# EAGLE design CC2533_PCB_Main_Plane (EAGLE 6.4)
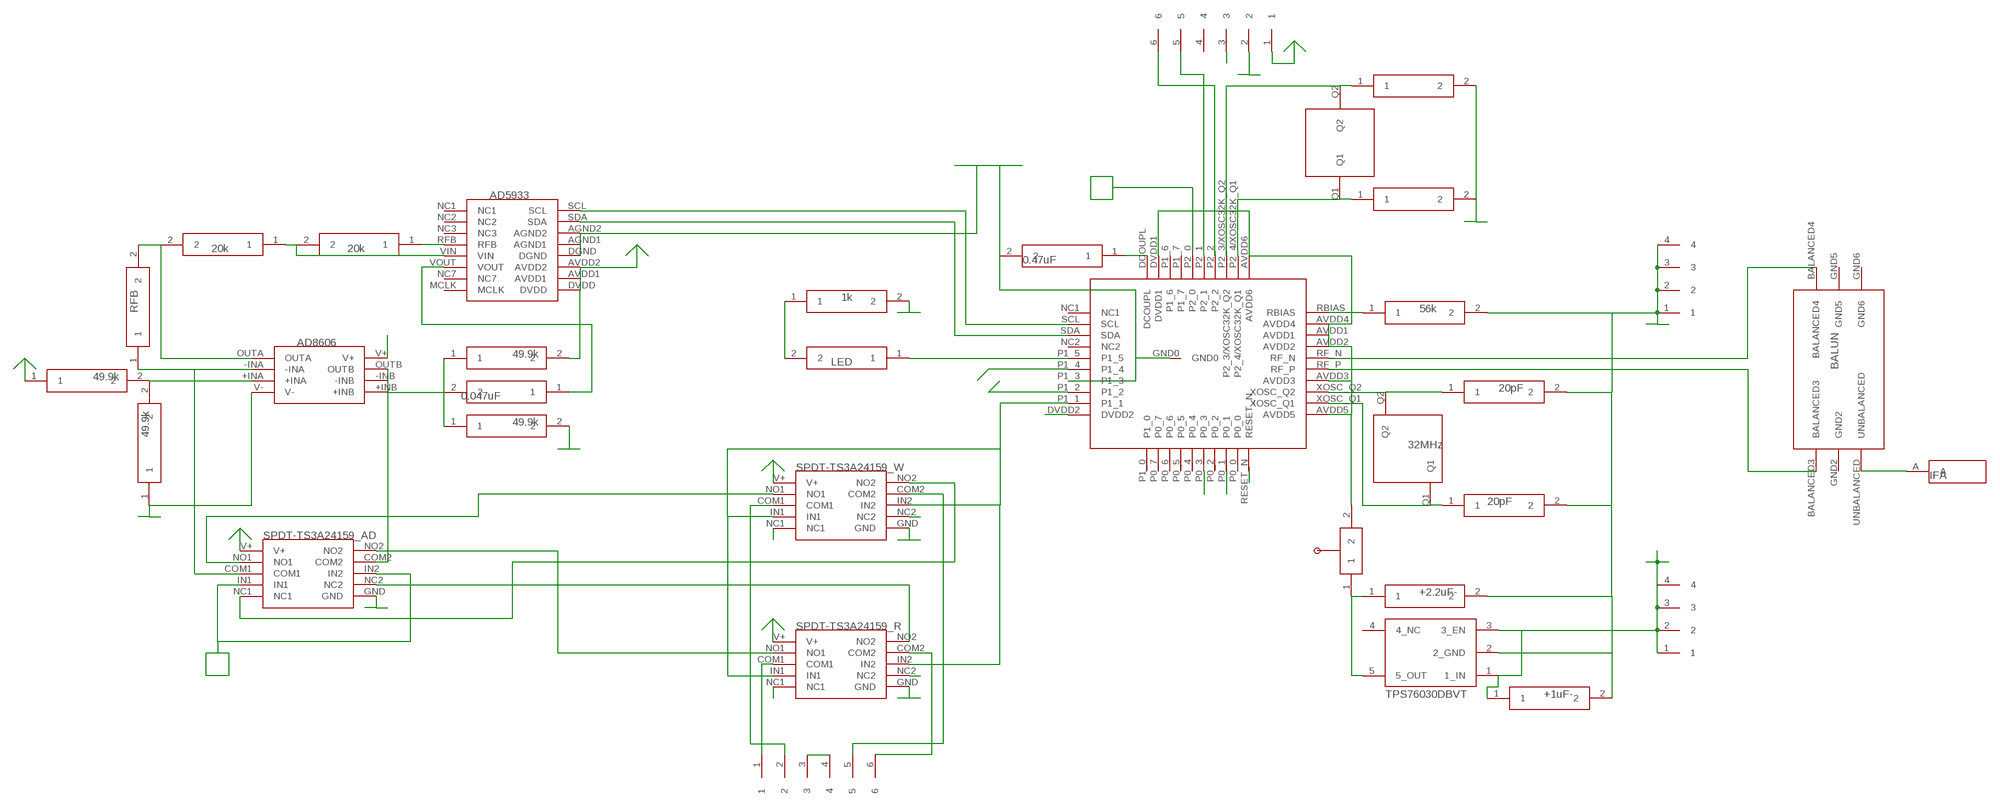
[diagram p0: schematic, sheet 1]

## Parts
U$1  CC2533  [CC2533]
U$2  BALUN  [BALUN]
U$3  X32MHZ  [X32MHZ]
U$4  0201  [0201]
U$5  0201  [0201]
U$6  ANTENNA_BOTTOM  [ANTENNA_BOTTOM]
U$7  FFC4POS  [FFC4POS]
U$8  FFC4POS  [FFC4POS]
U$9  56k  0201  [0201]
U$10  REGULATOR  [REGULATOR]
U$11  0603  [0603]
U$12  0603  [0603]
U$13  SPDT_DUAL  [SPDT_DUAL]
U$14  0201  [0201]
U$15  SPDT_DUAL  [SPDT_DUAL]
U$16  AD5933  [AD5933]
U$17  FFC6POS  [FFC6POS]
U$18  SWITCH_MANUAL  [SWITCH_MANUAL]
U$19  SPDT_DUAL  [SPDT_DUAL]
U$20  AD8606_OPAMP  [AD8606_OPAMP]
U$21  0603_RES  [0603_RES]
U$22  0603_RES  [0603_RES]
U$23  0603_RES  [0603_RES]
U$24  0201  [0201]
U$25  0201  [0201]
U$26  0402_CAP  [0402_CAP]
U$27  0201  [0201]
U$28  0201  [0201]
U$29  0603_RES  [0603_RES]
U$30  FFC6POS  [FFC6POS]
U$31  0402  [0402]
U$39  X32.768KHZ  [X32.768KHZ]
U$40  0201  [0201]
U$41  0201  [0201]

## Nets
GND: U$1.GND0 U$1.P1_3 U$4.2 U$5.2 U$8.1 U$8.2 U$8.3 U$8.4 U$9.2 U$10.2(2_GND) U$11.2 U$12.2 U$13.GND U$14.2 U$15.GND U$16.AGND1 U$16.AGND2 U$16.DGND U$17.2 U$19.GND U$20.V- U$25.1 U$28.2 U$30.3 U$30.4 U$31.2 U$40.2 U$41.2
IN1: U$1.P1_1 U$13.IN1 U$13.IN2 U$15.IN1 U$15.IN2
IN2: U$1.P2_0 U$19.IN1 U$19.IN2
LEFT: U$1.P1_4 U$15.NC1
N$1: U$1.RF_N U$2.BALANCED4
N$2: U$1.RF_P U$2.BALANCED3
N$3: U$2.UNBALANCED U$6.A
N$4: U$1.XOSC_Q2 U$3.Q2 U$5.1
N$5: U$1.XOSC_Q1 U$3.Q1 U$4.1
N$6: U$16.RFB U$21.1
N$7: U$15.NO1 U$19.NO1
N$8: U$15.NO2 U$19.NC1
N$9: U$13.COM1 U$30.1
N$10: U$13.COM2 U$30.6
N$11: U$19.COM1 U$20.-INA U$23.1
N$12: U$1.RBIAS U$9.1
N$13: U$1.SCL U$16.SCL
N$14: U$1.SDA U$16.SDA
N$15: U$15.COM1 U$30.2
N$16: U$1.P2_4/XOSC32K_Q1 U$39.Q1 U$41.1
N$17: U$1.P2_1 U$17.5
N$18: U$1.DCOUPL U$14.1
N$19: U$16.VOUT U$26.1
N$20: U$1.P2_2 U$17.6
N$21: U$10.5(5_OUT) U$11.1 U$18.1
N$22: U$1.P2_3/XOSC32K_Q2 U$39.Q2 U$40.1
N$23: U$16.VIN U$21.2 U$22.1
N$24: U$1.P1_5 U$29.1
N$25: U$20.OUTA U$22.2 U$23.2
N$27: U$20.+INA U$24.2 U$25.2
N$28: U$20.+INB U$26.2 U$27.1 U$28.1
N$29: U$19.COM2 U$20.-INB U$20.OUTB
N$30: U$15.COM2 U$30.5
N$31: U$13.NO1 U$19.NO2
N$32: U$13.NO2 U$19.NC2
N$34: U$29.2 U$31.1
P0_1: U$1.P0_1 U$13.NC1
P0_3: U$1.P0_3 U$13.NC2
RESET: U$1.RESET_N U$17.3
RIGHT: U$1.P1_2 U$15.NC2
V+: U$7.1 U$7.2 U$7.3 U$7.4 U$10.1(1_IN) U$10.3(3_EN) U$12.1
VDD: U$1.AVDD1 U$1.AVDD2 U$1.AVDD3 U$1.AVDD4 U$1.AVDD5 U$1.AVDD6 U$1.DVDD1 U$1.DVDD2 U$13.V+ U$15.V+ U$16.AVDD1 U$16.AVDD2 U$16.DVDD U$17.1 U$18.2 U$19.V+ U$20.V+ U$24.1 U$27.2
Unconnected: U$1.P0_0 U$1.P0_2 U$1.P0_4 U$1.P0_5 U$1.P0_6 U$1.P0_7 U$1.P1_0 U$1.P1_6 U$1.P1_7 U$10.4(4_NC) U$16.MCLK U$16.NC1 U$16.NC2 U$16.NC3 U$16.NC7 U$17.4

## Power pins joined to a net without a drawn wire
GND2: U$2.GND2
GND5: U$2.GND5
GND6: U$2.GND6
NC1: U$1.NC1
NC2: U$1.NC2

## Library data of the parts
U$1 = CC2530_PCB_TL:CC2533
U$2 = CC2530_PCB_TL:BALUN: 2.45 GHz Impedance Matched Balun-BPF: For TI CC253X, CC254X, CC257X, CC853X and CC852X Chipset family P/N 2450BM15A0002
U$3 = CC2530_PCB_TL:X32MHZ: X32MHz ABM12-32.000MHZ-B2X-T3; X: 32MHz
U$4 U$5 = CC2530_PCB_TL:0201: Package / Case 0201 (0603 Metric); CAP: 20pF
U$6 = CC2530_PCB_TL:ANTENNA_BOTTOM: Antenna for use in bottom layer of CC2530 PCB
U$7 U$8 = CC2530_PCB_TL:FFC4POS: FFC COnnector 4POS
U$9 = CC2530_PCB_TL:0201: Package / Case 0201 (0603 Metric); R_BIAS: 56k
U$10 = CC2530_PCB_TL:REGULATOR: IC REG LDO 3V 50MA SOT23-5 TPS76030DBVT
U$11 = CC2530_PCB_TL:0603: Package / Case 0603 (1608 Metric); CAP: +2.2uF-
U$12 = CC2530_PCB_TL:0603: Package / Case 0603 (1608 Metric); CAP: +1uF-
U$13 U$15 U$19 = CC2530_PCB_TL:SPDT_DUAL: TS3A24159DGSR IC SWITCH DUAL SPDT 10MSOP
U$14 = CC2530_PCB_TL:0201: Package / Case 0201 (0603 Metric); CAP: 0.47uF
U$16 = CC2530_PCB_TL:AD5933: AD5933
U$17 U$30 = CC2530_PCB_TL:FFC6POS: FFC Connector 6POS
U$18 = CC2530_PCB_TL:SWITCH_MANUAL
U$20 = CC2530_PCB_TL:AD8606_OPAMP: OPAMP AD8606ARMZ-REEL
U$21 U$22 = CC2530_PCB_TL:0603_RES; RES: 20k
U$23 U$29 = CC2530_PCB_TL:0603_RES
U$24 U$25 U$27 U$28 = CC2530_PCB_TL:0201: Package / Case 0201 (0603 Metric); RES: 49.9k
U$26 = CC2530_PCB_TL:0402_CAP; CAP: 0.047uF
U$31 = CC2530_PCB_TL:0402: Package / Case 0402 (1005 Metric); RES: 1k
U$39 = CC2530_PCB_TL:X32.768KHZ: X32.768kHz 9HT11-32.768KDZC-T
U$40 U$41 = CC2530_PCB_TL:0201: Package / Case 0201 (0603 Metric)

## Board
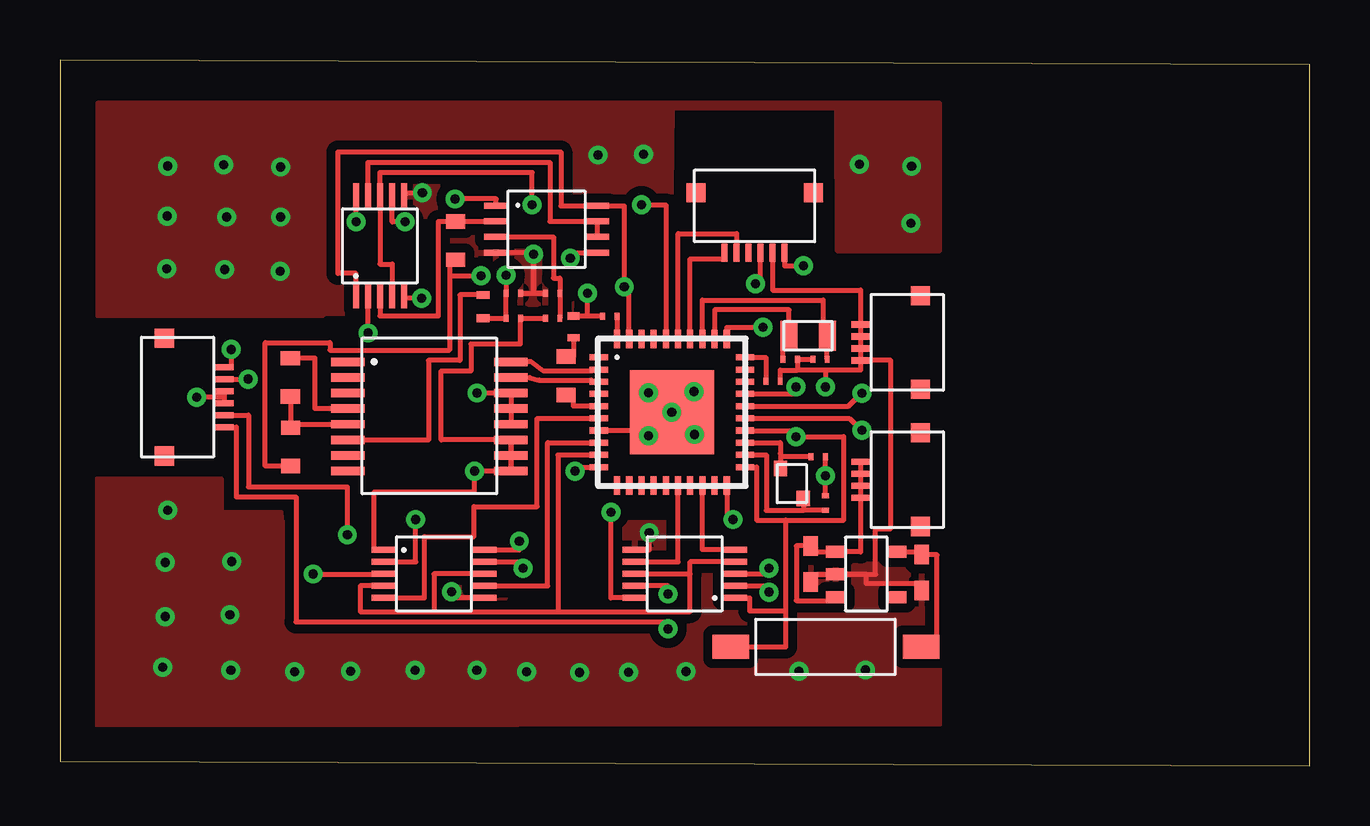
[diagram p1: board, top side]
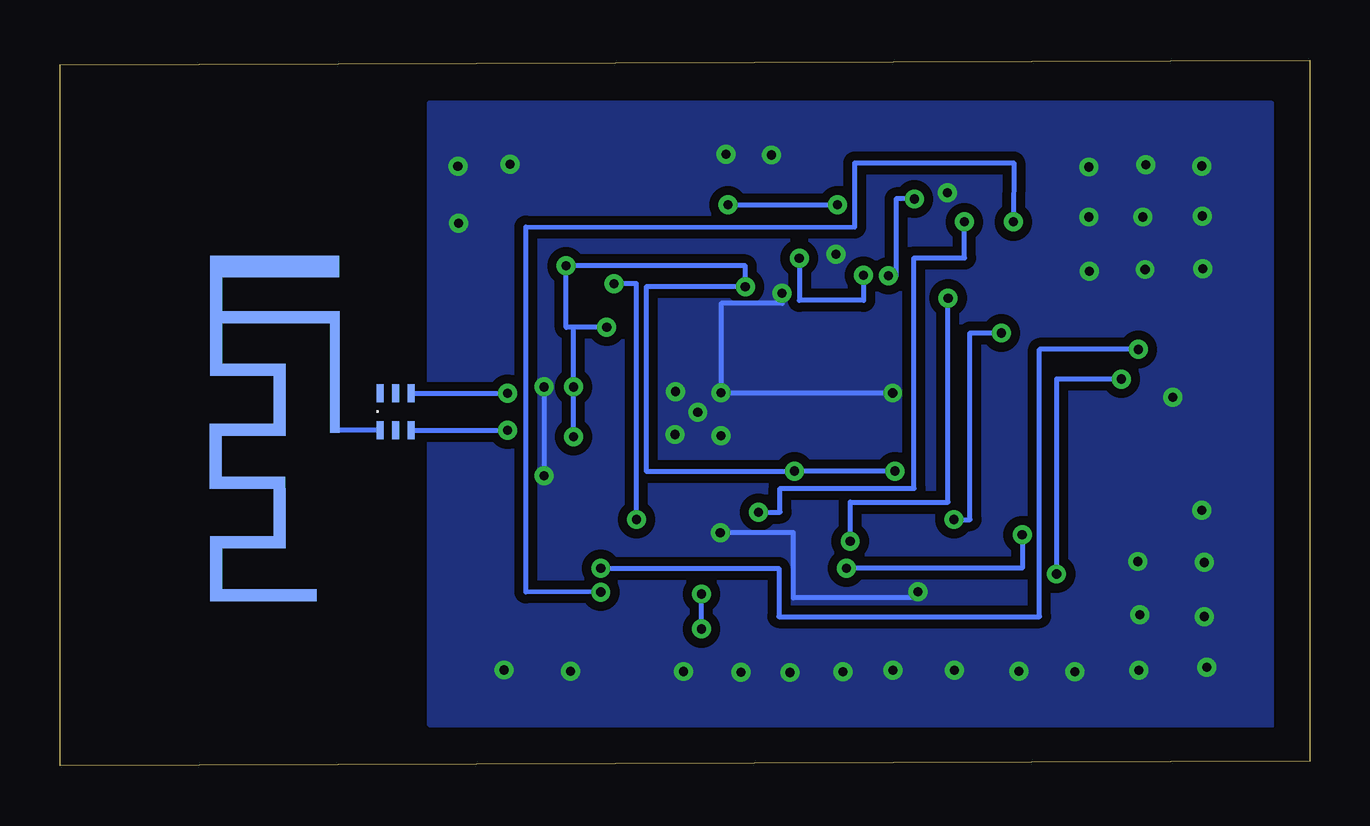
[diagram p2: board, bottom side, seen from below]

Size 52.09 x 29.4 mm. Coordinates in mm from the lower left corner, seen from the top.
Outline: 0,0.19 52.09,0 52.09,29.21 0,29.4 0,0.19
Copper layers (1*16): Top 0.035mm / dielectric 1.5mm / Bottom 0.035mm
Design rules "default *": minimum track width 8mil, minimum drill 15mil, track to track 6mil, track to pad 6mil, pad to pad 6mil, via to via 6mil, smd to smd 6mil, copper to edge 40mil, drill to drill 8mil, minimum pad ring 10mil, minimum via ring 8mil, stop-mask expansion 4mil, vias tented up to drill 0mil, thermal gap 10mil

### Footprints (pad centres in the part's own frame; a part is rotated, then mirrored left to right if it is on the bottom)
CC2533 = smd 0.762 x 0.254: AVDD1 3.048,1.27; AVDD2 3.048,0.762; AVDD3 3.048,-0.762; AVDD4 3.048,1.778; AVDD5 3.048,-2.286; DVDD2 -3.048,-2.286; NC1 -3.048,2.286; NC2 -3.048,0.762; P1_1 -3.048,-1.778; P1_2 -3.048,-1.27; P1_3 -3.048,-0.762; P1_4 -3.048,-0.254; P1_5 -3.048,0.254; RBIAS 3.048,2.286; RF_N 3.048,0.254; RF_P 3.048,-0.254; SCL -3.048,1.778; SDA -3.048,1.27; XOSC_Q1 3.048,-1.778; XOSC_Q2 3.048,-1.27 | smd 0.254 x 0.762: AVDD6 2.286,3.048; DCOUPL -2.286,3.048; DVDD1 -1.778,3.048; P0_0 1.778,-3.048; P0_1 1.27,-3.048; P0_2 0.762,-3.048; P0_3 0.254,-3.048; P0_4 -0.254,-3.048; P0_5 -0.762,-3.048; P0_6 -1.27,-3.048; P0_7 -1.778,-3.048; P1_0 -2.286,-3.048; P1_6 -1.27,3.048; P1_7 -0.762,3.048; P2_0 -0.254,3.048; P2_1 0.254,3.048; P2_2 0.762,3.048; P2_3/XOSC32K_Q2 1.27,3.048; P2_4/XOSC32K_Q1 1.778,3.048; RESET_N 2.286,-3.048 | smd 3.5 x 3.5: GND0 0,0
BALUN = smd 0.75 x 0.3: BALANCED3 -0.782,-0.655; BALANCED4 0.768,-0.655; GND2 -0.782,-0.005; GND5 0.768,-0.005; GND6 0.768,0.645; UNBALANCED -0.782,0.645
X32MHZ = smd 0.55 x 0.65: Q1 0.496,-0.576; Q2 -0.454,0.674
0201 = smd 0.203 x 0.3: 1 -0.3,-0.001; 2 0.3,-0.001
ANTENNA_BOTTOM = smd 0.203 x 0.203 bottom: A -0.014,-0.096 | smd 0.381 x 4.589 bottom: A1 -0.014,2.097 | smd 0.5 x 0.9 bottom: P$3 0.059,6.728 | smd 4.4 x 0.9 bottom: P$4 2.509,6.727 | smd 0.5 x 5 bottom: P$5 4.945,4.677 | smd 2.65 x 0.5 bottom: P$6 3.37,2.426; P$12 3.375,-2.271; P$14 3.372,-4.76 | smd 0.5 x 2 bottom: P$7 2.296,1.179; P$13 2.299,-3.512 | smd 4.4 x 0.5 bottom: P$8 2.495,4.627 | smd 0.5 x 2.7 bottom: P$9 4.948,-1.171; P$15 4.945,-5.861 | smd 3.94 x 0.5 bottom: P$10 2.725,-6.962 | smd 2.667 x 0.5 bottom: P$11 3.381,-0.071 | smd 0.5 x 0.5 bottom: P$16 0.045,4.627
FFC4POS = smd 0.762 x 0.254: 1 0.04,0.742; 2 0.04,0.242; 3 0.04,-0.258; 4 0.04,-0.758 | smd 0.8 x 0.8: P$5 -2.46,1.94; P$6 -2.46,-1.96
REGULATOR = smd 0.5 x 0.8: 1 0.94,1.275; 2 0,1.275; 3 -0.95,1.275; 4 -0.95,-1.275; 5 0.95,-1.275
0603 = smd 0.8 x 0.6: 1 -0.751,0; 2 0.749,0
SPDT_DUAL = smd 1.05 x 0.25: COM1 -2.075,0; COM2 2.075,0.5; GND 2.075,-1; IN1 -2.075,-0.5; IN2 2.075,0; NC1 -2.075,-1; NC2 2.075,-0.5; NO1 -2.075,0.5; NO2 2.075,1; V+ -2.075,1
AD5933 = smd 1.4 x 0.35: AGND1 3.45,0.25; AGND2 3.45,0.9; AVDD1 3.45,-1.7; AVDD2 3.45,-1.05; DGND 3.45,-0.4; DVDD 3.45,-2.35; MCLK -3.35,-2.35; NC1 -3.35,2.2; NC2 -3.35,1.55; NC3 -3.35,0.9; NC7 -3.35,-1.7; RFB -3.35,0.25; SCL 3.45,2.2; SDA 3.45,1.55; VIN -3.35,-0.4; VOUT -3.35,-1.05
FFC6POS = smd 0.762 x 0.254: 1 0.008,1.269; 2 0.008,0.769; 3 0.008,0.269; 4 0.008,-0.231; 5 0.008,-0.731; 6 0.008,-1.231 | smd 0.8 x 0.8: P$7 -2.49,2.47; P$8 -2.49,-2.43
SWITCH_MANUAL = smd 1.524 x 1.016: 1 -4.13,0; 2 3.81,0
AD8606_OPAMP = smd 1 x 0.25: +INA -2.1,-0.325; +INB 2.1,-0.975; -INA -2.1,0.325; -INB 2.1,-0.325; OUTA -2.1,0.975; OUTB 2.1,0.325; V+ 2.1,0.975; V- -2.1,-0.975
0603_RES = smd 0.6 x 0.8: 1 -0.8,0; 2 0.8,0
0402_CAP = smd 0.33 x 0.533: 1 -0.475,0.001; 2 0.501,0.001
0402 = smd 0.3 x 0.5: 1 -0.45,0.001; 2 0.45,0.001
X32.768KHZ = smd 1.25 x 0.7: Q1 0.009,-0.811; Q2 0.009,0.789

### Placement (x,y rotation side)
U$1  25.51,14.72 0 top
U$2  38.1,14.75 90 bottom
U$3  30.49,11.7 0 top
U$4  31.91,10.94 90 top
U$5  31.6,12.87 0 top
U$6  40.64,14.06 0 top
U$7  33.41,11.9 180 top
U$8  33.41,17.62 180 top
U$9  29.72,16.02 0 top
U$10  33.61,7.97 90 top
U$11  35.92,8.04 270 top
U$12  31.3,8.4 270 top
U$13  26.04,7.99 180 top
U$14  22.92,18.72 180 top
U$15  15.59,7.99 0 top
U$16  15.35,14.62 0 top
U$17  28.94,21.38 270 top
U$18  31.76,4.95 180 top
U$19  13.33,21.66 90 top
U$20  20.28,22.35 0 top
U$21  9.61,16.17 270 top
U$22  9.61,13.28 270 top
U$23  16.49,21.87 270 top
U$24  20.54,18.64 0 top
U$25  20.54,19.68 0 top
U$26  17.63,19.13 270 top
U$27  18.9,18.64 0 top
U$28  18.9,19.68 0 top
U$29  21.1,16.25 90 top
U$30  6.84,15.33 0 top
U$31  21.42,18.28 90 top
U$39  31.2,17.92 270 top
U$40  31.68,16.93 180 top
U$41  30.43,16.93 0 top

### Tracks (layer width: path | path; a pad name or v marks a point on that pad's centre or on a via)
GND  (via drill 0.38 pad 0.64)
  Top 0.203: U$4.2 v31.91,12.08 U$5.2 31.91,12.82 | U$9.2 30.02,16.47 30.73,16.47 | U$40.2 30.84,16.93 U$41.2 30.73,16.47 | U$8.1 U$8.2 U$8.3 U$8.4 33.37,19.81 29.7,19.81 U$17.2 | U$8.1 33.37,16.47 31.91,16.47 | 31.91,16.47 30.73,16.47 | U$12.2 31.43,7.96 U$10.2 | U$11.2 35.92,7.58 33.61,7.58 33.61,7.96 U$10.2 | U$16.AGND1 U$16.AGND2 v17.38,15.52 | U$16.AGND1 U$16.DGND | 19.24,14.87 U$16.AGND1 | U$20.V- 18.38,21.38 19.74,21.38 19.74,19.68 | U$31.2 U$14.2 21.99,18.72 v21.99,19.68 | U$30.4 U$30.3 6.85,15.35 v5.7,15.35 | 31.91,16.47 v31.91,15.78 | v24.56,9.7 24.56,8.99 U$13.GND | U$15.GND 16.33,6.99 v16.33,7.24 | U$10.2 33.99,7.96 33.99,9.87 34.62,9.87 34.62,16.89 U$8.1 | U$1.GND0 26.28,14.72 | 26.28,14.72 26.28,15.77 | 26.63,15.77 26.63,15.93 26.18,15.75 26.55,15.77 26.55,15.52 24.57,15.52 | 26.71,13.59 26.71,13.57 26.54,13.73 26.54,14.72 26.28,14.72 | 23.91,13.59 23.91,13.96 | 23.91,13.96 U$1.P1_3 | U$28.2 19.74,19.68 | 19.74,19.68 U$25.1 19.75,19.68 v19.75,21.3 | U$19.GND 14.34,23.87 14.35,23.87 v15.1,23.87 | 23.91,13.96 25.51,13.96 U$1.GND0 | U$1.GND0 24.53,14.72 v24.53,15.52 | v24.53,15.52 24.57,15.52 | 24.57,15.52 24.57,15.53 v24.53,15.53 v24.53,15.52
  Bottom 0.203: v31.91,15.78 31.91,12.15 v31.91,12.08 | v16.33,7.24 16.33,6.98 16.42,6.98 21.52,6.99 21.52,9.7 v24.56,9.7 | v21.99,19.68 21.99,19.26 24.53,19.26 v24.53,15.52 | v15.1,23.87 15.06,23.74 15.07,23.74 15.07,23.71 | v5.7,15.35 5.42,15.35 | v19.75,21.3 19.74,21.37 19.74,21.39 | v17.38,15.52 v24.53,15.52 | v24.53,15.52 v24.53,15.53
  other vias: 4.38,8.46 21.66,3.88 23.7,3.89 26.1,3.92 7.12,3.98 4.28,4.1 4.38,6.21 33.58,3.98 30.81,3.93 6.94,22.85 24.32,25.48 35.47,22.59 33.33,25.05 6.86,20.67 6.83,25.03 9.19,24.94 9.17,20.59 25.5,14.72 26.43,15.58 26.45,13.79 24.53,13.74 9.2,22.85 7.15,8.5 7.08,6.28 35.5,24.97 22.43,25.44 4.45,20.7 4.47,22.9 4.49,24.98 19.45,3.9 17.37,3.98 14.81,3.98 12.12,3.93 9.78,3.9 4.49,10.64
  pour Bottom (isolate 0.381): 1.57,27.59 36.69,27.61 36.69,1.7 1.57,1.68
  pour Top (isolate 0.381): 1.57,18.76 10.95,18.76 10.76,18.85 21.33,18.85 21.41,20.52 25.45,20.52 25.53,27.42 32.36,27.42 32.39,21.46 36.67,21.46 36.67,27.59 1.57,27.59
  pour Top (isolate 0.381): 1.57,11.95 6.71,11.95 6.71,10.56 9.2,10.56 9.23,10.13 26.68,10.13 26.72,8.37 30.84,8.4 30.76,8.4 36.66,8.41 36.66,1.71 1.57,1.68
IN1
  Top 0.203: U$13.IN1 26.27,8.49 26.27,7.99 | U$1.P1_1 20.76,12.94 20.76,6.41 | U$13.IN2 26.27,7.99 | 20.76,6.41 26.27,6.41 26.27,7.99 | U$15.IN2 15.59,7.99 15.59,6.41 | U$15.IN1 12.52,7.49 12.52,6.41 15.59,6.41 | 15.59,6.41 20.76,6.41
IN2  (via drill 0.38 pad 0.64)
  Top 0.203: U$19.IN1 13.85,19.88 13.85,20.89 13.34,20.89 U$19.IN2 13.34,24.7 19.68,24.7 v19.68,23.36 | v24.24,23.36 25.25,23.36 U$1.P2_0
  Bottom 0.203: v24.24,23.36 v19.68,23.36
LEFT
  Top 0.203: U$15.NC1 15.19,6.99 15.19,9.54 17.25,9.54 17.25,10.79 19.89,10.79 19.89,14.46 U$1.P1_4
N$1  (via drill 0.38 pad 0.64)
  Top 0.203: U$1.RF_N 32.87,14.98 33.41,15.51 v33.43,15.51
  Bottom 0.203: U$2.BALANCED4 v33.43,15.51
N$2  (via drill 0.38 pad 0.64)
  Top 0.203: U$1.RF_P 32.9,14.47 33.4,13.96 v33.43,13.96
  Bottom 0.203: U$2.BALANCED3 v33.43,13.96
N$3
  Bottom 0.203: U$2.UNBALANCED U$6.A | U$6.A
N$4
  Top 0.203: U$1.XOSC_Q2 30.03,13.45 30.03,12.99 U$3.Q2 30.03,12.87 U$5.1
N$5
  Top 0.203: U$1.XOSC_Q1 29.44,12.94 29.44,10.63 30.98,10.63 | U$4.1 30.98,10.63 | U$3.Q1 30.98,10.63
N$6
  Top 0.203: U$16.RFB 10.63,14.87 10.63,16.98 U$21.1
N$7  (via drill 0.38 pad 0.64)
  Top 0.203: U$15.NO1 14.82,8.49 v14.82,10.25 | v12.85,18.02 12.85,19.88 U$19.NO1
  Bottom 0.203: v14.82,10.25 14.15,10.25 14.15,18.02 v12.85,18.02
N$8  (via drill 0.38 pad 0.64)
  Top 0.203: U$15.NO2 19.15,8.99 v19.15,9.34 | v15.07,19.48 14.35,19.48 U$19.NC1
  Bottom 0.203: v19.15,9.34 19.15,10.97 15.07,10.97 v15.07,19.48
N$9  (via drill 0.38 pad 0.64)
  Top 0.203: U$13.COM1 29.55,7.99 v29.55,8.22 | v7.13,17.34 7.13,16.6 U$30.1
  Bottom 0.203: v29.55,8.22 22.12,8.22 22.12,6.2 11.26,6.2 11.26,17.34 v7.13,17.34
N$10  (via drill 0.38 pad 0.64)
  Top 0.203: U$30.6 7.35,14.1 7.35,11.19 9.84,11.19 9.84,5.98 25.35,5.98 v25.35,5.69 | v25.34,7.15 25.34,7.49 U$13.COM2
  Bottom 0.203: v25.35,5.69 25.35,7 v25.34,7.15
N$11
  Top 0.203: U$20.-INA 16.34,22.67 U$23.1 15.77,22.67 15.77,18.73 13.34,18.73 U$19.COM1
N$12
  Top 0.203: U$1.RBIAS 29.42,17.01 U$9.1
N$13
  Top 0.203: U$1.SCL 22.17,16.5 22.17,16.43 20.16,16.43 19.63,16.83 19.24,16.83 U$16.SCL
N$14
  Top 0.203: U$16.SDA 19.58,16.16 19.97,16.06 22.15,16.06 22.2,15.98 U$1.SDA
N$15  (via drill 0.38 pad 0.64)
  Top 0.203: U$30.2 7.81,16.1 v7.84,16.1 | v10.55,7.98 U$15.COM1
  Bottom 0.203: v7.84,16.1 10.55,16.1 v10.55,7.98
N$16
  Top 0.203: U$41.1 30.13,17.91 U$39.Q1 30.39,18.99 27.29,18.99 U$1.P2_4/XOSC32K_Q1
N$17
  Top 0.203: U$1.P2_1 25.76,22.16 28.2,22.16 U$17.5
N$18
  Top 0.203: U$14.1 U$1.DCOUPL
N$19
  Top 0.203: U$26.1 16.67,19.61 16.67,16.88 15.36,16.88 15.36,13.56 12.44,13.56 U$16.VOUT
N$20
  Top 0.203: U$1.P2_2 26.27,21.11 27.7,21.11 U$17.6
N$21
  Top 0.203: U$10.5 35.92,8.91 U$11.1 36.56,8.78 36.56,4.97 35.89,4.97 U$18.1
N$22
  Top 0.203: U$40.1 31.98,17.91 | U$1.P2_3/XOSC32K_Q2 26.78,19.39 31.81,19.39 31.81,17.91 31.98,17.91 | 31.98,17.91 U$39.Q2
N$23
  Top 0.203: U$16.VIN 9.61,14.22 U$22.1 U$21.2
N$24
  Top 0.203: U$1.P1_5 21.4,14.98 21.4,15.45 U$29.1
N$25  (via drill 0.38 pad 0.64)
  Top 0.203: U$22.2 8.55,12.48 8.55,17.62 11.25,17.62 11.25,17.31 16.24,17.31 16.24,21.07 U$23.2 16.24,21.07 16.24,20.41 v17.55,20.41 | U$20.OUTA 18.18,23.61 v16.47,23.61
  Bottom 0.203: v16.47,23.61 17.24,23.61 17.24,20.41 v17.55,20.41
N$27
  Top 0.203: U$20.+INA 20.57,22.02 20.57,20.3 20.84,20.3 U$25.2 U$24.2
N$28  (via drill 0.38 pad 0.64)
  Top 0.203: U$26.2 U$27.1 U$28.1 v18.59,20.43 | v21.27,21.14 21.27,21.37 U$20.+INB
  Bottom 0.203: v18.59,20.43 18.59,19.38 21.27,19.38 v21.27,21.14
N$29
  Top 0.203: U$20.-INB U$20.OUTB 20.43,22.67 20.43,25.14 12.84,25.14 U$19.COM2
N$30  (via drill 0.38 pad 0.64)
  Top 0.203: U$15.COM2 19.29,8.49 v19.3,8.22 | U$30.5 7.86,14.6 7.86,11.61 11.98,11.61 v11.98,9.62
  Bottom 0.203: v11.98,9.62 11.98,8.22 v19.3,8.22
N$31  (via drill 0.38 pad 0.64)
  Top 0.203: U$13.NO1 29.55,7.49 v29.55,7.23 | v12.34,22.65 12.34,24.03 U$19.NO2
  Bottom 0.203: v29.55,7.23 32.66,7.23 32.66,22.44 18.95,22.43 18.95,25.12 12.33,25.12 v12.34,22.65
N$32  (via drill 0.38 pad 0.64)
  Top 0.203: U$13.NO2 22.97,6.99 v22.97,10.56 | v14.39,22.65 13.85,22.65 13.85,24.03 U$19.NC2
  Bottom 0.203: v22.97,10.56 22.07,10.56 22.07,11.55 16.49,11.55 16.49,21.15 14.39,21.15 v14.39,22.65
N$34
  Top 0.203: U$31.1 21.42,17.05 U$29.2
P0_1
  Top 0.203: 26.8,11.67 U$1.P0_1 26.78,9 U$13.NC1
P0_3
  Top 0.203: U$13.NC2 25.76,8.49 U$1.P0_3
RESET  (via drill 0.38 pad 0.64)
  Top 0.203: 29.21,21.37 U$17.3 29.19,20.08 v28.99,20.08 | U$1.RESET_N 27.79,10.25 v28.06,10.25
  Bottom 0.203: v28.06,10.25 28.06,20.08 v28.99,20.08
RIGHT
  Top 0.203: U$15.NC2 20.32,7.49 20.32,13.45 U$1.P1_2
V+
  Top 0.203: U$10.3 32.33,6.87 30.69,6.87 30.69,9.15 U$12.1 31.43,8.9 U$10.1 33.37,8.9 U$7.1 U$7.2 U$7.3 U$7.4
VDD  (via drill 0.38 pad 0.64)
  Top 0.203: U$1.AVDD4 U$1.AVDD1 U$1.AVDD2 30.68,15.48 v30.68,15.78 | U$1.AVDD5 29.04,12.44 29.04,10.23 30.26,10.23 | 30.26,10.23 32.67,10.23 32.67,13.71 v30.68,13.71 30.68,13.96 U$1.AVDD3 | 30.26,6.44 30.26,4.95 U$18.2 | 30.26,6.44 30.26,10.23 | U$16.AVDD2 U$16.AVDD1 U$16.DVDD | U$16.AVDD2 U$16.DVDD | U$24.1 U$27.2 19.2,17.57 17.13,17.57 | U$16.AVDD2 15.89,13.57 15.89,16.45 17.13,16.45 17.13,17.57 | U$16.DVDD v17.28,12.27 17.28,11.4 13.1,11.4 13.1,8.99 U$15.V+ | v21.47,12.27 21.47,12.44 U$1.DVDD2 | U$13.V+ 28.74,6.99 28.74,6.44 30.26,6.44 | U$19.V+ 12.34,20.51 11.59,20.51 11.59,25.57 20.88,25.57 20.88,23.32 U$20.V+ 23.52,23.32 v23.52,19.94 23.73,19.94 U$1.DVDD1 | 17.13,17.57 | U$1.AVDD6 27.79,18.26 v29.3,18.26 | U$17.1 30.2,20.82 v30.99,20.82
  Bottom 0.203: 30.68,18.26 30.99,18.26 v30.99,20.82 | 30.68,18.26 v30.68,15.78 v30.68,13.71 | v17.28,12.27 v21.47,12.27 27.65,12.27 27.65,19.94 v23.52,19.94 23.52,20.82 v30.99,20.82 | v29.3,18.26 30.68,18.26 | v30.99,20.82 30.86,20.82